# EAGLE design FXIMU (EAGLE 7.7.0)
COMPANY: ADAFRUIT INDUSTRIES; DRAWN: KTOWN; REV: A

## Sheet 1 of 2
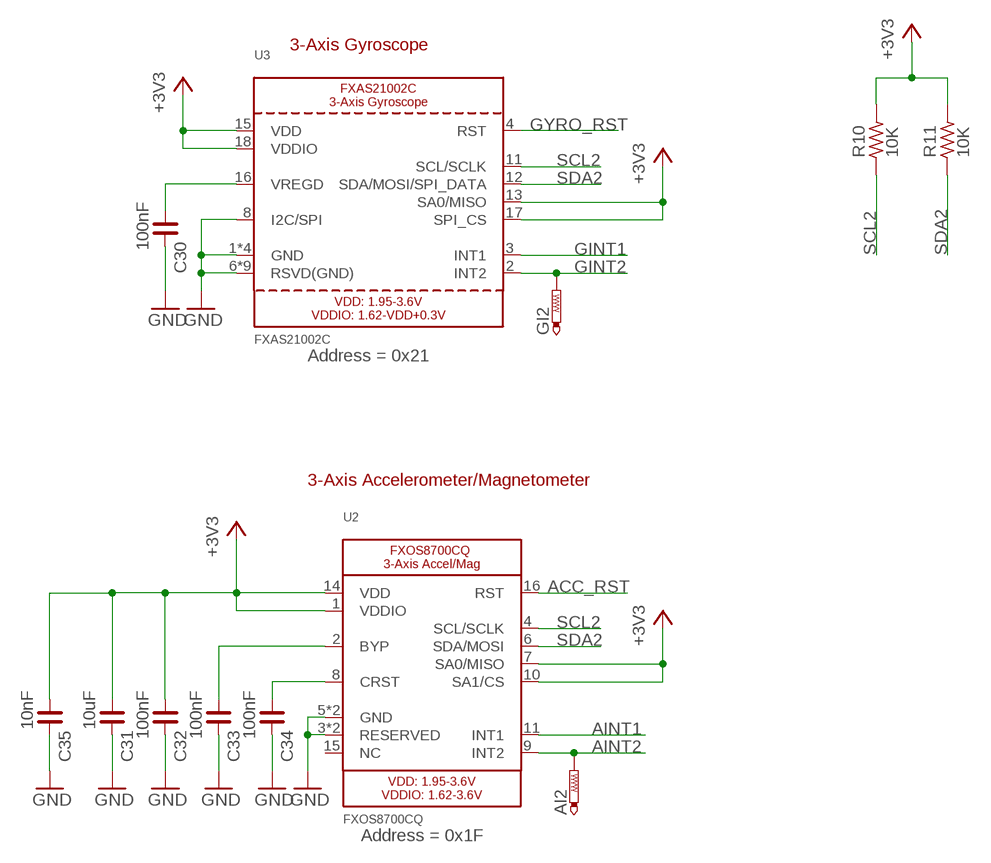
[diagram p0: schematic, sheet 1]

### Parts
AI2  PTR1TP06R  [TP06R]
C30  100nF  C_0402  [C0402]
C31  10uF  C_0603  [C0603]
C32  100nF  C_0402  [C0402]
C33  100nF  C_0402  [C0402]
C34  100nF  C_0402  [C0402]
C35  10nF  C_0402  [C0402]
GI2  PTR1TP06R  [TP06R]
R10  10K  R_0402  [R0402]
R11  10K  R_0402  [R0402]
U2  FXOS8700CQ  ACCEL_MAG_FXOS8700CQ  [QFN16_3MM_FREESCALE_5X3]
U3  FXAS21002C  GYRO_FXAS21002C  [QFN24_4MM_FREESCALE_7X5]

### Nets
+3V3: C31.1 C32.1 C35.1 R10.2 R11.2 U2.1(VDDIO) U2.7(SA0/MISO) U2.10(SA1/CS) U2.14(VDD) U3.13(SA0/MISO) U3.15(VDD) U3.17(SPI_CS) U3.18(VDDIO) ; also sheet 2
ACC_RST: U2.16(RST) ; also sheet 2
AINT1: U2.11(INT1) ; also sheet 2
AINT2: AI2.TP U2.9(INT2) ; also sheet 2
GINT1: U3.3(INT1) ; also sheet 2
GINT2: GI2.TP U3.2(INT2) ; also sheet 2
GND: C30.2 C31.2 C32.2 C33.2 C34.2 C35.2 U2.3(RESERVED) U2.5(GND) U2.12(GND) U2.13(RESERVED) U3.1(GND) U3.5(GND) U3.6(RSVD(GND)) U3.7(RSVD(GND)) U3.8(I2C/SPI) U3.9(RSVD(GND)) U3.10(RSVD(GND)) U3.14(GND) U3.19(GND) U3.20(RSVD(GND)) U3.21(RSVD(GND)) U3.22(RSVD(GND)) U3.23(RSVD(GND)) U3.24(RSVD(GND)) ; also sheet 2
GYRO_RST: U3.4(RST) ; also sheet 2
N$1: C30.1 U3.16(VREGD)
N$24: C33.1 U2.2(BYP)
N$26: C34.1 U2.8(CRST)
SCL2: R10.1 U2.4(SCL/SCLK) U3.11(SCL/SCLK) ; also sheet 2
SDA2: R11.1 U2.6(SDA/MOSI) U3.12(SDA/MOSI/SPI_DATA) ; also sheet 2
Unconnected: U2.15(NC)

### Notes on the sheet
- 3-Axis Gyroscope
- Address = 0x21
- 3-Axis Accelerometer/Magnetometer
- Address = 0x1F

## Sheet 2 of 2
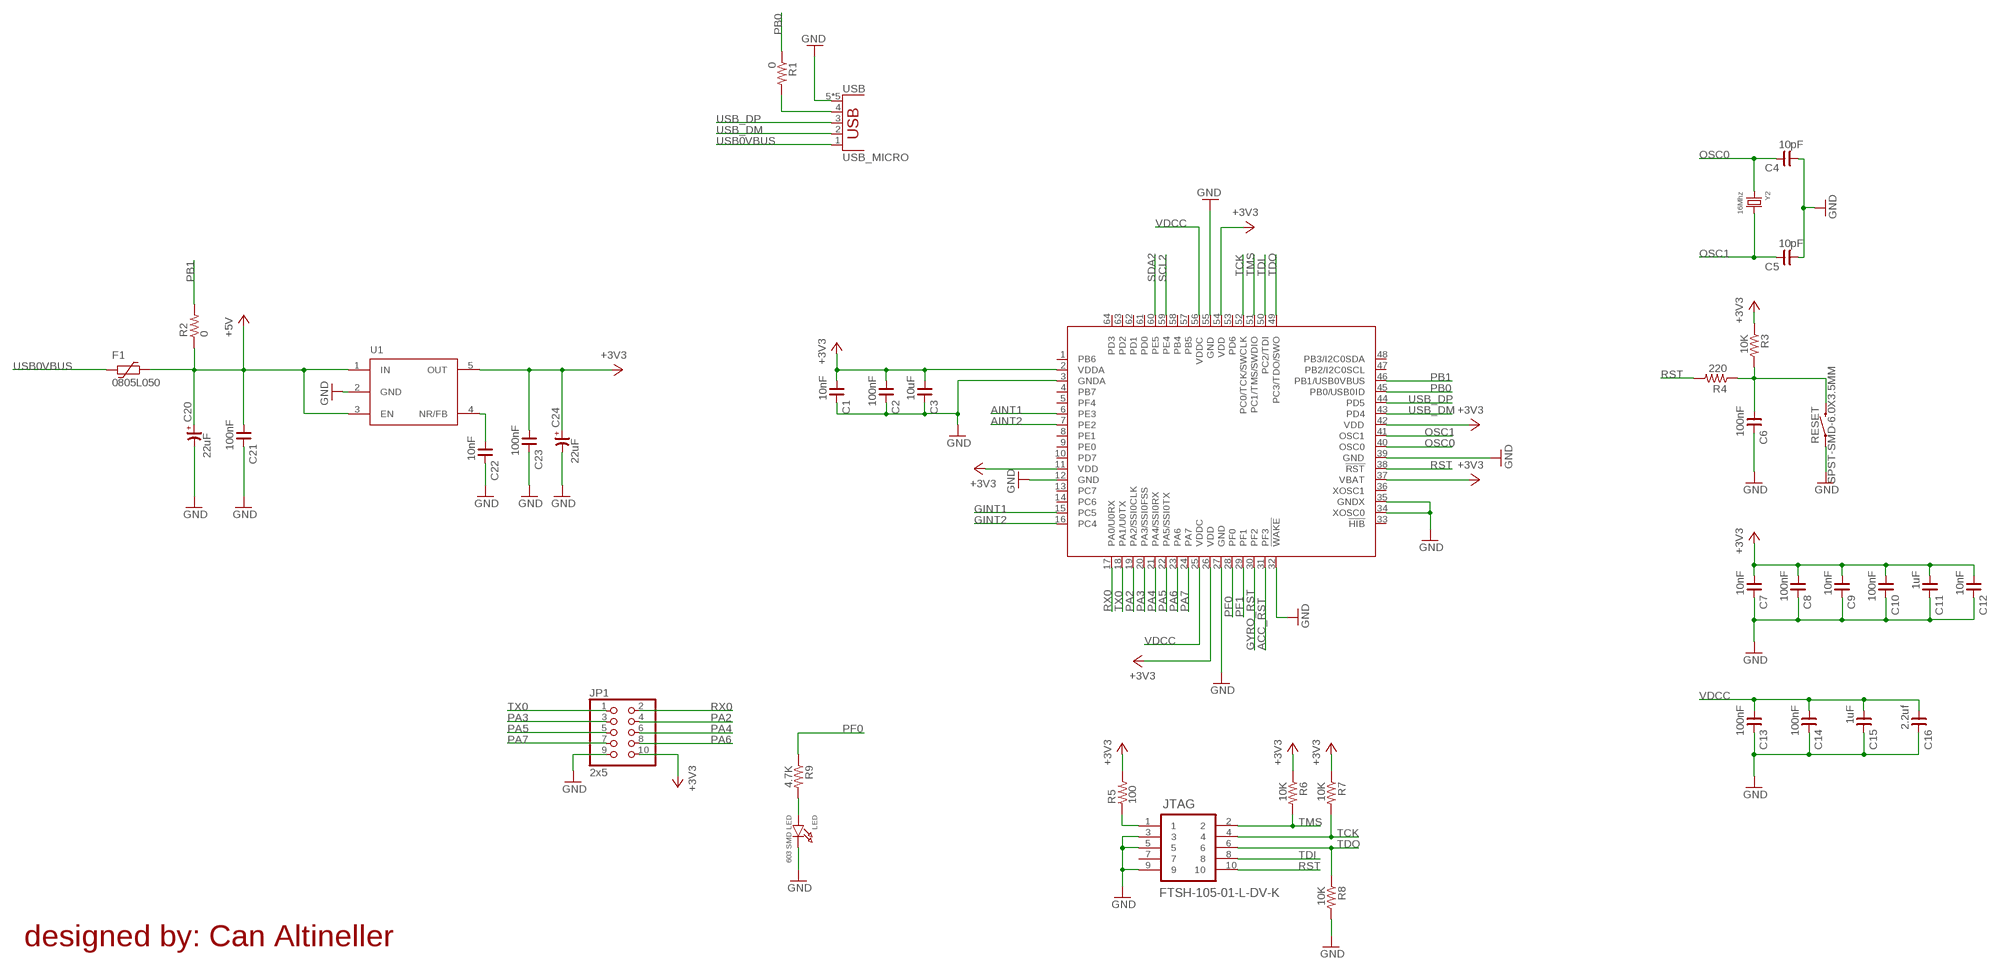
[diagram p1: schematic, sheet 2]

### Parts
C1  10nF  C_0402  [C0402]
C2  100nF  C_0402  [C0402]
C3  10uF  C_0603  [C0603]
C4  10pF  C_0402  [C0402]
C5  10pF  C_0402  [C0402]
C6  100nF  C_0402  [C0402]
C7  10nF  C_0402  [C0402]
C8  100nF  C_0402  [C0402]
C9  10nF  C_0402  [C0402]
C10  100nF  C_0402  [C0402]
C11  1uF  C_0402  [C0402]
C12  10nF  C_0402  [C0402]
C13  100nF  C_0402  [C0402]
C14  100nF  C_0402  [C0402]
C15  1uF  C_0402  [C0402]
C16  2.2uf  C_0603  [C0603]
C20  22uF  CP_3528-21  [C3528-21/T]
C21  100nF  C_0402  [C0402]
C22  10nF  C_0402  [C0402]
C23  100nF  C_0402  [C0402]
C24  22uF  CP_3528-21  [C3528-21/T]
F1  0805L050  [0805L]
IC1  TM4C123[7,G]XXPM  [PM_S-PQFP-G64]
JP1  2x5  PINHD-2X5  [2X05]
JTAG  FTSH-105-01-L-DV-K  [SAMTEC_FTSH-105-01-L-DV-K]
LED  603 SMD LED  LED0603  [CHIPLED_0603]
R1  0  R_0402  [R0402]
R2  0  R_0402  [R0402]
R3  10K  R_0402  [R0402]
R4  220  R_0402  [R0402]
R5  100  R_0402  [R0402]
R6  10K  R_0402  [R0402]
R7  10K  R_0402  [R0402]
R8  10K  R_0402  [R0402]
R9  4.7K  R_0402  [R0402]
RESET  SPST-SMD-6.0X3.5MM  MOMENTARY-SWITCH-SPST-SMD-6.0X3.5MM  [TACTILE_SWITCH_SMD_6.0X3.5MM]
U1  TPS73633  [SOT23-5L]
USB  USB_MICRO  [USB_MICRO_MOLEX_FULL]
Y2  16Mhz  CRYSTAL.6X3.3MM  [6X3.3MM]

### Nets
+3V3: C1.1 C2.1 C3.1 C7.1 C8.1 C9.1 C10.1 C11.1 C12.1 C23.1 C24.+ IC1.2(VDDA) IC1.11(VDD) IC1.26(VDD) IC1.37(VBAT) IC1.42(VDD) IC1.54(VDD) JP1.10 R3.1 R5.2 R6.1 R7.1 U1.5(OUT) ; also sheet 1
+5V: C20.+ C21.1 F1.1 R2.1 U1.1(IN) U1.3(EN)
ACC_RST: IC1.31(PF3) ; also sheet 1
AINT1: IC1.6(PE3) ; also sheet 1
AINT2: IC1.7(PE2) ; also sheet 1
GINT1: IC1.15(PC5) ; also sheet 1
GINT2: IC1.16(PC4) ; also sheet 1
GND: C1.2 C2.2 C3.2 C4.1 C5.1 C6.2 C7.2 C8.2 C9.2 C10.2 C11.2 C12.2 C13.2 C14.2 C15.2 C16.2 C20.- C21.2 C22.2 C23.2 C24.- IC1.3(GNDA) IC1.12(GND) IC1.27(GND) IC1.32(!WAKE) IC1.34(XOSC0) IC1.35(GNDX) IC1.39(GND) IC1.55(GND) JP1.9 JTAG.3 JTAG.5 JTAG.9 LED.C R8.2 RESET.1 U1.2(GND) USB.5(GND) USB.P$1(GND) USB.P$2(GND) USB.P$3(GND) USB.P$4(GND) ; also sheet 1
GYRO_RST: IC1.30(PF2) ; also sheet 1
N$2: JTAG.1 R5.1
N$4: C6.1 R3.2 R4.1 RESET.2
N$7: LED.A R9.2
N$8: R1.2 USB.4(ID)
N$17: C22.1 U1.4(NR/FB)
OSC0: C4.2 IC1.40(OSC0) Y2.1
OSC1: C5.2 IC1.41(OSC1) Y2.2
PA2: IC1.19(PA2/SSI0CLK) JP1.4
PA3: IC1.20(PA3/SSI0FSS) JP1.3
PA4: IC1.21(PA4/SSI0RX) JP1.6
PA5: IC1.22(PA5/SSI0TX) JP1.5
PA6: IC1.23(PA6) JP1.8
PA7: IC1.24(PA7) JP1.7
PB0: IC1.45(PB0/USB0ID) R1.1
PB1: IC1.46(PB1/USB0VBUS) R2.2
PF0: IC1.28(PF0) R9.1
PF1: IC1.29(PF1)
RST: IC1.38(!RST) JTAG.10 R4.2
RX0: IC1.17(PA0/U0RX) JP1.2
SCL2: IC1.59(PE4) ; also sheet 1
SDA2: IC1.60(PE5) ; also sheet 1
TCK: IC1.52(PC0/TCK/SWCLK) JTAG.4 R7.2
TDI: IC1.50(PC2/TDI) JTAG.8
TDO: IC1.49(PC3/TDO/SWO) JTAG.6 R8.1
TMS: IC1.51(PC1/TMS/SWDIO) JTAG.2 R6.2
TX0: IC1.18(PA1/U0TX) JP1.1
USB0VBUS: F1.2 USB.1(VBUS)
USB_DM: IC1.43(PD4) USB.2(D-)
USB_DP: IC1.44(PD5) USB.3(D+)
VDCC: C13.1 C14.1 C15.1 C16.1 IC1.25(VDDC) IC1.56(VDDC)
Unconnected: IC1.1(PB6) IC1.4(PB7) IC1.5(PF4) IC1.8(PE1) IC1.9(PE0) IC1.10(PD7) IC1.13(PC7) IC1.14(PC6) IC1.33(!HIB) IC1.36(XOSC1) IC1.47(PB2/I2C0SCL) IC1.48(PB3/I2C0SDA) IC1.53(PD6) IC1.57(PB5) IC1.58(PB4) IC1.61(PD0) IC1.62(PD1) IC1.63(PD2) IC1.64(PD3) JTAG.7

### Notes on the sheet
- designed by: Can Altineller

## Library data of the parts
AI2 GI2 = testpad:PTR1: TEST PIN
C1-C16 C21-C23 C30-C35 = rc-master-smd:C_: NON-POLARIZED CAP
C20 C24 = rc-master-smd:CP_: POLARIZED CAP
F1 = polyfuse-smd_10:?: Polyfuse Resettable PTC Source: http://www.littelfuse.com/products/resettable-ptcs.aspx; MF: Littelfuse; MPN: 0805L050; OC_FARNELL: 1832103; OC_NEWARK: 18M4776
IC1 = ti-tiva:TM4C123[7,G]XX
JP1 = pinhead:PINHD-2X5: PIN HEADER
JTAG = FTSH-105-01-L-DV-K:FTSH-105-01-L-DV-K: CONN HEADER, 1.27MM, 2X5WAY, SMT; AVAILABILITY: Good; DESCRIPTION: Conn Unshrouded Header HDR 10 POS 1.27mm Solder ST SMD Automotive Tube; MF: Samtec; MP: FTSH-105-01-L-DV-K; PACKAGE: TSSOP-20 Texas Instruments; PRICE: 1.93 USD
LED = microbuilder:LED: LED 0603 - 0603 Surface Mount Package 2mA: Green LED - Low Power (3.9mcd, 2ma, 1.7Vf) - Digikey: 475-2709-2-ND Orange LED - Low Power (9.8mcd, 2ma, 1.8Vf) - Digikey: 475-1194-2-ND Red LED - Low Power (5mcd, 2ma, 1.8Vf) - Digikey: 475-1195-2-ND Yellow LED - Low Power (7mcd, 2ma, 1.8Vf) - Digikey: 475-1196-2-ND 5mA: Blue LED - Low Power (17mcd, 5ma, 2.9Vf) - Digikey: LNJ937W8CRACT-ND 0805 - 0805 Surface Mount Package 2mA: Red LED (8.8mcd, 2mA, 1.8Vf, Clear) - Low Power [Digikey: 475-2510-1-ND] Green LED (5mcd, 2mA, 1.8Vf, Clear) - Low Power [Digikey: 475-2730-1-ND] Yellow LED (11.3mcd, 2mA, 1.8Vf, Clear) - Low Power [Digikey: 475-2555-1-ND] 20mA: Red LED (104mcd, 20mA, Diffused) - LS R976 [Digikey: 475-1278-6-ND] Red LED (12mcd, 20mA, 2.0Vf, Clear) - APT2012EC [Digikey: 754-1128-1-ND] Green LED (15mcd, 20mA, 2.2Vf, Clear) - APT2012GC [Digikey: 754-1131-1-ND] Orange LED (160mcd, 20mA, 2.1Vf, Clear) - APT2012SECK [Digikey: 754-1130-1-ND] 1206 - 1206 Surface Mount Package Green LED (26mcd, 20mA, Diffused) - LG N971 [Digikey: 475-1407-6-ND] Red LED (15mcd, 20mA, Diffused) - LH N974 [Digikey: 475-1416-6-ND]
R1-R11 = rc-master-smd:R_: RESISTOR
RESET = SparkFun-Switches:MOMENTARY-SWITCH-SPST: Momentary Switch (Pushbutton) - SPST Normally-open (NO) SPST momentary switches (buttons, pushbuttons). Variants PTH-12MM - 12mm square, through-hole Momentary Pushbutton Switch - 12mm Square <https://www.sparkfun.com/products/9190> (COM-09190) PTH-6.0MM, PTH-6.0MM-KIT - 6.0mm square, through-hole Mini Pushbutton Switch <https://www.sparkfun.com/products/97> (COM-00097) KIT package intended for soldering kit's - only one side of pads' copper is exposed. PTH-RIGHT-ANGLE-KIT - Right-angle, through-hole Right Angle Tactile Button <https://www.sparkfun.com/products/10791> - Used on SparkFun BigTime Watch Kit <https://www.sparkfun.com/products/11734> SMD-12MM - 12mm square, surface-mount Tactile Button - SMD (12mm) <https://www.sparkfun.com/products/12993> (COM-12993) Used on SparkFun PicoBoard <https://www.sparkfun.com/products/11888> SMD-4.5MM - 4.5mm Square Trackball Switch Used on SparkFun Blackberry Trackballer Breakout <https://www.sparkfun.com/products/13169> SMD-4.6MMX2.8MM - 4.60mm x 2.80mm, surface mount Used on SparkFun SAMD21 Mini Breakout <https://www.sparkfun.com/products/13664> SMD-5.2MM, SMD-5.2-REDUNDANT - 5.2mm square, surface-mount Mini Pushbutton Switch - SMD <https://www.sparkfun.com/products/8720> (COM-08720) Used on Arduino Pro Mini <https://www.sparkfun.com/products/11114> REDUNDANT package connects both switch circuits together SMD-6.0X3.5MM - 6.0 x 3.5mm, surface mount Momentary Reset Switch SMD <https://www.sparkfun.com/products/8229> (COM-08229) SMD-6.2MM-TALL - 6.2mm square, surface mount Tactile Button - SMD (6mm) <https://www.sparkfun.com/products/12992> Used on SparkFun Digital Sandbox <https://www.sparkfun.com/products/12651> SMD-RIGHT-ANGLE - Right-angle, surface mount Used on SparkFun Block for Intel® Edison - Arduino <https://www.sparkfun.com/products/13036>; PROD_ID: SWCH-00815; SF_SKU: COM-08229
U1 = tpslib:TPS73633
U2 = microbuilder:ACCEL_MAG_FXOS8700CQ: FX0S8700CQ - 3-Axis Accelerometer and Magnetometer Accel Range: +/-2/4/8 g Accel Data Rate: 1.6-800Hz (400Hz in hybrid mode) Accel Resolution: 14-bits Mag Range: 1200uT Mag Data Rate: 1.6-800Hz (400Hz in hybrid mode) Mag Resolution: 16-bits
U3 = microbuilder:GYRO_FXAS21002C: FXAS21002C - 3 Axis Gyroscope - 250/500/1000/2000dps Range: 250/500/1000/2000 dps Data Rate: 2.5-800Hz Resolution: 16-bits
USB = FLYTRON:USB_MICRO
Y2 = abracon:CRYSTAL

## Board
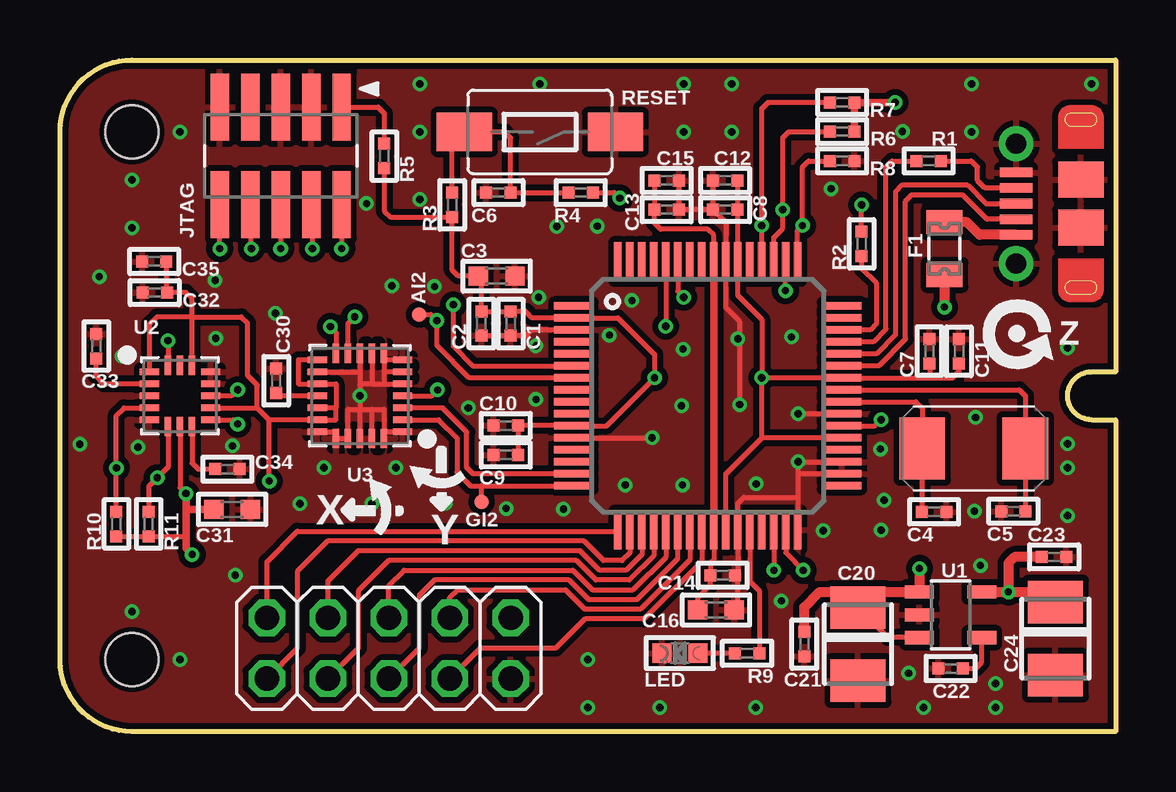
[diagram p2: board, top side]
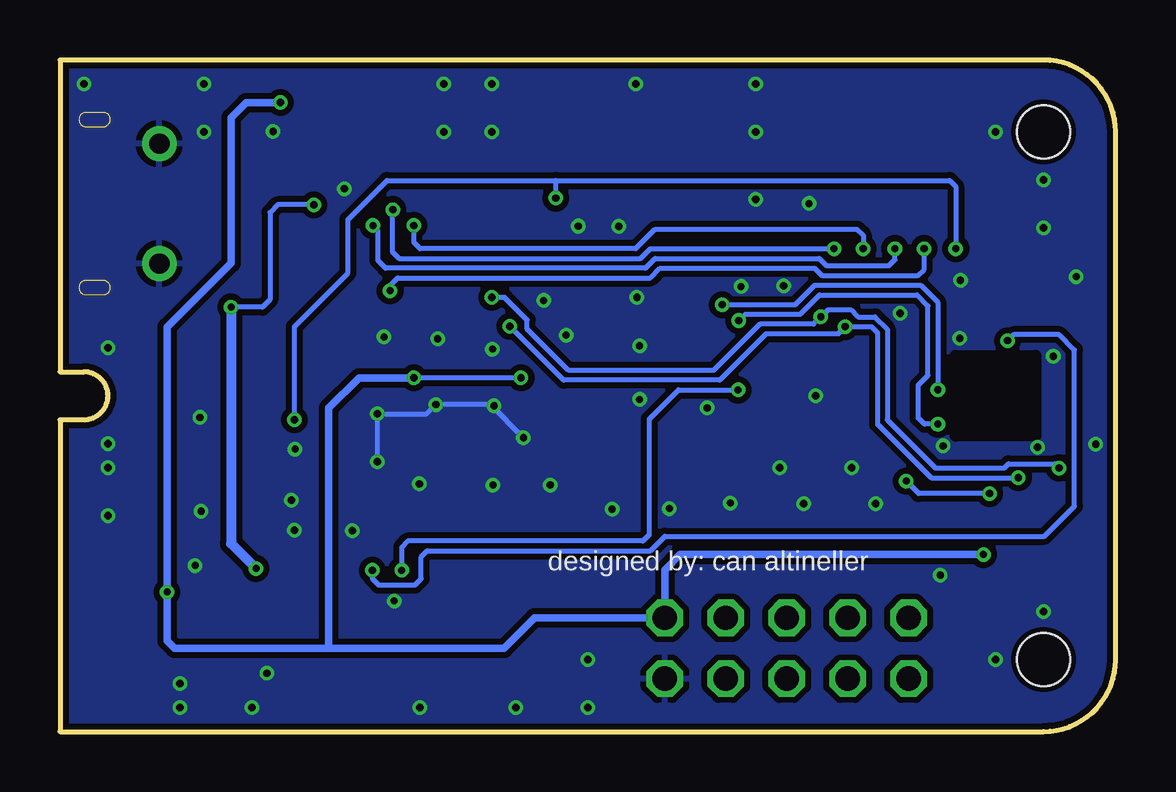
[diagram p3: board, bottom side, seen from below]

Size 44 x 28 mm. Coordinates in mm from the lower left corner, seen from the top.
Outline: 44,0 3,0 arc-90 0,3 0,25 arc-90 3,28 44,28 44,15 43,15 arc180 43,13 44,13 44,0
Copper layers (1*16): Top 0.035mm / dielectric 1.5mm / Bottom 0.035mm
Design rules "adafruit *": minimum track width 6mil, minimum drill 11mil, track to track 6mil, track to pad 6mil, pad to pad 6mil, via to via 6mil, smd to smd 0mil, copper to edge 10mil, drill to drill 10mil, minimum pad ring 10mil, minimum via ring 6mil, stop-mask expansion 2mil, vias tented up to drill 12mil, thermal gap 10mil
Holes 2.2 mm at 3,3 3,25
tRestrict: area 12.7,15.3 to 12.8,16.2; area 13.2,15.3 to 13.3,16.2; area 13.8,15.2 to 14.7,15.3; area 13.8,14.7 to 14.7,14.8; area 12.2,11.8 to 12.3,12.7; area 13.2,11.8 to 13.3,12.7; area 4.3,13.3 to 5.7,14.7
bRestrict: area 3.3,12.3 to 6.7,15.7

### Footprints (pad centres in the part's own frame; a part is rotated, then mirrored left to right if it is on the bottom)
TP06R = smd 0.6 x 0.6: TP 0,0
C0402 = smd 0.5 x 0.5: 1 -0.508,0; 2 0.508,0
C0603 = smd 0.8 x 0.8: 1 -0.762,0; 2 0.762,0
C3528-21/T = smd 1.778 x 2.286: + 1.524,0; - -1.524,0
0805L = smd 1 x 1.5: 1 -1.1,0; 2 1.1,0
PM_S-PQFP-G64 = smd 1.6 x 0.3: 1 -5.6,3.75; 2 -5.6,3.25; 3 -5.6,2.75; 4 -5.6,2.25; 5 -5.6,1.75; 6 -5.6,1.25; 7 -5.6,0.75; 8 -5.6,0.25; 9 -5.6,-0.25; 10 -5.6,-0.75; 11 -5.6,-1.25; 12 -5.6,-1.75; 13 -5.6,-2.25; 14 -5.6,-2.75; 15 -5.6,-3.25; 16 -5.6,-3.75; 33 5.6,-3.75; 34 5.6,-3.25; 35 5.6,-2.75; 36 5.6,-2.25; 37 5.6,-1.75; 38 5.6,-1.25; 39 5.6,-0.75; 40 5.6,-0.25; 41 5.6,0.25; 42 5.6,0.75; 43 5.6,1.25; 44 5.6,1.75; 45 5.6,2.25; 46 5.6,2.75; 47 5.6,3.25; 48 5.6,3.75 | smd 0.3 x 1.6: 17 -3.75,-5.6; 18 -3.25,-5.6; 19 -2.75,-5.6; 20 -2.25,-5.6; 21 -1.75,-5.6; 22 -1.25,-5.6; 23 -0.75,-5.6; 24 -0.25,-5.6; 25 0.25,-5.6; 26 0.75,-5.6; 27 1.25,-5.6; 28 1.75,-5.6; 29 2.25,-5.6; 30 2.75,-5.6; 31 3.25,-5.6; 32 3.75,-5.6; 49 3.75,5.6; 50 3.25,5.6; 51 2.75,5.6; 52 2.25,5.6; 53 1.75,5.6; 54 1.25,5.6; 55 0.75,5.6; 56 0.25,5.6; 57 -0.25,5.6; 58 -0.75,5.6; 59 -1.25,5.6; 60 -1.75,5.6; 61 -2.25,5.6; 62 -2.75,5.6; 63 -3.25,5.6; 64 -3.75,5.6
2X05 = drill 1.016 octagon: 1 -5.08,-1.27; 2 -5.08,1.27; 3 -2.54,-1.27; 4 -2.54,1.27; 5 0,-1.27; 6 0,1.27; 7 2.54,-1.27; 8 2.54,1.27; 9 5.08,-1.27; 10 5.08,1.27
SAMTEC_FTSH-105-01-L-DV-K = smd 0.762 x 2.794: 1 -2.54,-2.032; 2 -2.54,2.032; 3 -1.27,-2.032; 4 -1.27,2.032; 5 0,-2.032; 6 0,2.032; 7 1.27,-2.032; 8 1.27,2.032; 9 2.54,-2.032; 10 2.54,2.032
CHIPLED_0603 = smd 0.8 x 0.8: A 0,-0.75; C 0,0.75
R0402 = smd 0.5 x 0.5: 1 -0.508,0; 2 0.508,0
TACTILE_SWITCH_SMD_6.0X3.5MM = smd 2.3 x 1.6: 1 -3.15,0; 2 3.15,0
SOT23-5L = smd 0.55 x 1.2: 1 -0.95,-1.3; 2 0,-1.3; 3 0.95,-1.3; 4 0.95,1.3; 5 -0.95,1.3
QFN16_3MM_FREESCALE_5X3 = smd 0.8 x 0.275: 1 -1.275,1; 2 -1.275,0.5; 3 -1.275,0; 4 -1.275,-0.5; 5 -1.275,-1; 9 1.275,-1; 10 1.275,-0.5; 11 1.275,0; 12 1.275,0.5; 13 1.275,1 | smd 0.275 x 0.8: 6 -0.5,-1.275; 7 0,-1.275; 8 0.5,-1.275; 14 0.5,1.275; 15 0,1.275; 16 -0.5,1.275
QFN24_4MM_FREESCALE_7X5 = smd 0.8 x 0.275: 1 -1.775,1.5; 2 -1.775,1; 3 -1.775,0.5; 4 -1.775,0; 5 -1.775,-0.5; 6 -1.775,-1; 7 -1.775,-1.5; 13 1.775,-1.5; 14 1.775,-1; 15 1.775,-0.5; 16 1.775,0; 17 1.775,0.5; 18 1.775,1; 19 1.775,1.5 | smd 0.275 x 0.8: 8 -1,-1.775; 9 -0.5,-1.775; 10 0,-1.775; 11 0.5,-1.775; 12 1,-1.775; 20 1,1.775; 21 0.5,1.775; 22 0,1.775; 23 -0.5,1.775; 24 -1,1.775
USB_MICRO_MOLEX_FULL = smd 0.4 x 1.35: 1 -1.29,2.644; 2 -0.64,2.644; 3 0.01,2.644; 4 0.66,2.644; 5 1.31,2.644 | drill 0.85 pad 1.45: P$1 -2.49,2.644; P$2 2.51,2.644 | smd 1.5 x 1.9: P$3 1.01,-0.056; P$4 -0.99,-0.056
6X3.3MM = smd 1.9 x 2.6: 1 -2.15,0; 2 2.15,0

### Placement (x,y rotation side)
AI2  14.98,17.39 0 top
C1  18.79,17.01 270 top
C2  17.57,17.01 270 top
C3  18.2,18.99 0 top
C4  36.44,9.16 180 top
C5  39.74,9.19 0 top
C6  18.28,22.47 180 top
C7  36.24,15.86 90 top
C8  27.73,21.76 180 top
C9  18.58,11.53 180 top
C10  18.58,12.75 180 top
C11  37.48,15.86 90 top
C12  27.73,22.98 180 top
C13  25.29,21.76 0 top
C14  27.62,6.52 0 top
C15  25.29,22.98 0 top
C16  27.35,5.07 0 top
C20  33.26,3.65 90 top
C21  31.03,3.65 270 top
C22  37.12,2.63 180 top
C23  41.44,7.28 0 top
C24  41.49,3.88 90 top
C30  9.01,14.62 90 top
C31  7.18,9.26 0 top
C32  3.95,18.3 180 top
C33  1.51,16.07 90 top
C34  6.98,10.94 0 top
C35  3.93,19.6 180 top
F1  36.87,20.13 90 top
GI2  17.57,9.57 0 top
IC1  27,14 0 top
JP1  13.71,3.47 0 top
JTAG  9.2,24 180 top
LED  25.85,3.27 90 top
R1  36.21,23.79 0 top
R2  33.42,20.34 270 top
R3  16.35,21.96 90 top
R4  21.71,22.47 0 top
R5  13.52,23.99 270 top
R6  32.6,25.01 180 top
R7  32.6,26.23 180 top
R8  32.6,23.79 0 top
R9  28.64,3.27 180 top
R10  2.35,8.65 270 top
R11  3.7,8.65 270 top
RESET  20,25 180 top
U1  37.12,4.87 270 top
U2  5,14 0 top
U3  12.5,14 180 top
U$27  [SYMBOL_GYRO_CCLOCKWISE]  11.68,7.98 0 top
U$28  [SYMBOL_GYRO_CLOCKWISE]  14.3,12.23 270 top
U$31  [SYMBOL_GYRO_Z]  38.46,15.12 0 top
USB  42.5,22 90 top
Y2  38.09,11.8 0 top

### Tracks (layer width: path | path; a pad name or v marks a point on that pad's centre or on a via)
+3V3  (via drill 0.3)
  Top 0.203: C12.1 C8.1 28.25,21.74 IC1.54 28.25,18.19 29.25,17.18 v29.25,14.75 | 36.26,14.75 IC1.42 v29.25,14.75 | 36.26,14.75 37.22,14.75 37.48,15 C11.1 | C7.1 36.26,15.35 36.26,14.75 | U2.14 | U2.14 | U3.13 9.93,15.5 9.93,14.5 U3.15 11.5,14.5 11.5,13.5 | 11.5,13.5 U3.17 | 11.5,13.5 11.5,13 U3.18 8.72,13 | IC1.26 27.75,10.75 29.25,12.25 | C9.1 C10.1 IC1.11 22.78,12.75 v24.78,14.75 24.78,15.73 23.26,17.25 IC1.2 19.69,17.25 19.42,17.52 C1.1 C2.1 17.57,18.86 C3.1 16.6,18.99 16.35,19.24 R3.1 13.77,21.45 13.52,21.71 R5.2 | IC1.37 29.25,12.25 | 29.25,12.25 v29.25,14.75 | U2.7 5,10.18 v5.25,9.92 | U2.1 3.73,16.97 4.04,17.29 5.5,17.29 | U2.10 8.22,13.5 | U2.14 5.5,17.29 | 5.5,17.29 7.56,17.29 7.81,17.03 7.81,14.85 8.22,14.44 8.22,13.5 | 8.22,13.5 8.72,13 | R10.2 R11.2 5.25,8.14 | 5.5,17.29 5.5,18.05 5.25,18.3 C32.1 4.44,18.33 C35.1 | v8.72,10.44 8.72,13
  Top 0.305: v34.81,26.23 R7.1 R6.1 | v5.51,7.38 5.25,7.64 5.25,8.14 5.25,9.16 | 5.25,9.16 v5.25,9.92 | C31.1 5.36,9.26 5.25,9.16
  Top 0.406: U1.5 v39.54,5.82 | v39.54,5.82 41.24,5.82 41.49,5.56 C24.+ | C23.1 39.79,7.28 39.54,7.03 v39.54,5.82
  Bottom 0.203: v24.78,14.75 v29.25,14.75 | v5.25,9.92 8.2,9.92 v8.72,10.44
  Bottom 0.305: v34.81,26.23 36.23,26.23 36.87,25.59 36.87,19.52 39.54,16.86 v39.54,5.82 39.54,3.79 39.22,3.47 32.81,3.47 | v29.25,14.75 31.54,14.75 32.81,13.48 32.81,3.47 | v5.51,7.38 18.15,7.38 18.79,6.75 JP1.10 24.22,4.74 25.49,3.47 32.81,3.47
+5V  (via drill 0.3)
  Top 0.203: U1.3 34.52,3.92 C20.+ | R2.1 v33.42,21.96
  Top 0.406: F1.1 v36.87,17.69 | C21.1 31.03,5.18 31.66,5.82 33.31,5.82 | 33.31,5.82 U1.1 v35.83,6.8 | C20.+ 33.26,5.77 33.31,5.82
  Bottom 0.203: v33.42,21.96 34.93,21.96 35.25,21.64 35.25,18.01 35.56,17.69 v36.87,17.69
  Bottom 0.406: v36.87,17.69 36.87,7.84 v35.83,6.8
ACC_RST  (via drill 0.3)
  Top 0.203: v4.5,16.3 U2.16 | IC1.31 30.25,7.45 v30.98,6.72
  Bottom 0.203: v4.5,16.3 4.25,16.55 2.35,16.55 1.72,15.92 1.72,9.39 2.96,8.14 18.79,8.14 19.39,7.53 28.69,7.53 28.95,7.28 28.95,6.37 29.2,6.11 30.72,6.11 30.98,6.37 v30.98,6.72
AINT1  (via drill 0.3)
  Top 0.203: v7.41,14.25 7.15,14 U2.11 | IC1.6 17.21,15.25 16.4,16.06 v16.4,17.8
  Bottom 0.203: v7.41,14.25 7.41,17.9 8.12,18.61 12.54,18.61 13.35,17.8 v16.4,17.8
AINT2  (via drill 0.3)
  Top 0.203: IC1.7 17.06,14.75 15.71,16.1 v15.71,17.14 15.46,17.39 AI2.TP | U2.9 7.22,13 v7.41,12.82
  Bottom 0.203: v15.71,17.14 15.43,17.39 13.15,17.39 12.33,18.2 8.27,18.2 7.81,17.75 7.81,14.85 8.22,14.44 8.22,13.07 7.96,12.82 v7.41,12.82
GINT1
  Top 0.203: IC1.15 17.21,10.75 16.96,11 16.96,12.48 15.94,13.5 U3.3
GINT2
  Top 0.203: U3.2 15.79,13 16.55,12.24 16.55,10.81 17.11,10.25 17.57,10.25 | 17.57,10.25 IC1.16 | GI2.TP 17.57,10.25
GND  (via drill 0.3)
  Top 0.203: C12.2 C8.2 | C15.2 C13.2 C8.2 | C8.2 27.75,21.23 IC1.55 27.75,17.67 28.34,17.09 v28.34,13.63 | U3.14 12.5,15 | 13.5,15 U3.8 13.5,15.5 U3.7 | 13.5,14.5 U3.5 | U3.6 13.5,15 | 13.5,15 13.5,14.5 | U3.9 13,14.5 | U3.10 12.5,15 | 12.5,13.43 12,13.43 U3.21 U3.20 11.5,12.5 U3.19 | 12.52,13.43 13,13.43 | 13,13.43 13.5,13.43 U3.24 13.5,12.5 U3.1 | U3.22 12.52,12.22 12.52,13.43 | U3.23 13,13.43 | 12.5,15 12.5,14.44 | 12.5,14.44 12.5,13.43 | 12.5,13.43 12.52,13.43 | 13,14.5 12.56,14.5 arc90 12.5,14.44 | 13,14.5 13.5,14.5 | IC1.3 19.67,16.75 19.42,16.5 C1.2 C2.2 | IC1.32 30.77,8.4 30.77,9.77 | 30.77,9.77 30.77,10.75 | 30.77,10.75 v30.77,11.25 IC1.35 | IC1.34 30.77,10.75 | IC1.39 v30.77,13.25 | 30.77,9.77 28.5,9.77 28.25,9.52 IC1.27 28.25,6.64 C14.2 28.26,6.39 28.26,5.22 C16.2 | IC1.12 v24.68,12.25
  Bottom 0.203: v30.77,11.25 v30.77,13.25 28.72,13.25 v28.34,13.63 26.06,13.63 v24.68,12.25
  other vias: 12.5,14 17.02,13.49 20.7,21.06 19.84,16.08 19.84,13.85 5,25 3,23 3,5 5,3 3,21 15,25 26,25 28,25 38,25 43,27 38,27 28,27 26,27 15,27 42,16 42,12 42,11 42,9 39,2 39,1 36,1 29,1 25,1 22,1 22,3 3.25,11.86 2.59,15.64 7.19,11.91 11,11 14,11 10,9.5 25.97,15.94 30.5,16.45 28.26,16.37 25.95,10.28 29.02,10.33 23.56,10.28 23.84,17.97 22.9,16.53 34.23,8.4 31.82,8.37 34.2,11.78 38.37,6.92 35.37,2.43 6.47,18.81 1.64,18.96 7.3,6.52 15,22.19 22.39,21.07 19.95,18.1 12.78,22.02 38.11,9.19 34.36,9.64 38.17,13.1 30.07,5.45 25.91,13.59 13,9.5 0.83,11.98 6.49,16.4 8.98,17.44 13.83,18.58 15.61,18.56 16.06,9.53 20.98,9.27 18.6,9.3 20,27 35.12,25.02 32.14,22.63
  pour Bottom (isolate 0.254): 44,28 3,28 arc90 0,25 0,3 arc90 3,0 44,0
  pour Top (isolate 0.254): 44,28 3,28 arc90 0,25 0,3 arc90 3,0 44,0
GYRO_RST  (via drill 0.3)
  Top 0.203: U3.4 15.5,14 v15.74,14.24 | IC1.30 v29.76,6.72
  Bottom 0.203: v15.74,14.24 18.23,14.24 19.45,13.02 19.45,8.2 19.7,7.94 29.5,7.94 29.76,7.69 v29.76,6.72
N$1
  Top 0.203: U3.16 9.13,14 arc-90 C30.1
N$2
  Top 0.203: JTAG.1 13.27,26.03 13.52,25.78 R5.1
N$4
  Top 0.203: R4.1 C6.1 18.79,24.75 18.53,25 RESET.2 16.35,24.5 R3.2
N$7
  Top 0.203: R9.2 LED.A
N$8
  Top 0.203: USB.4 38.56,22.66 38.24,22.98 38.24,23.54 37.99,23.79 R1.2
N$17
  Top 0.203: C22.1 38.17,2.63 38.42,2.89 U1.4
N$24
  Top 0.203: U2.2 1.83,14.5 1.51,14.82 C33.1
N$26
  Top 0.203: U2.8 5.5,11.19 5.75,10.94 C34.1
OSC0
  Top 0.203: IC1.40 35.69,13.75 35.94,13.5 Y2.1 C4.2
OSC1
  Top 0.203: IC1.41 39.99,14.25 40.24,14 Y2.2 C5.2
PA2
  Top 0.203: JP1.4 11.17,6.26 12.44,7.53 21.68,7.53 22.49,6.72 23.59,6.72 24.25,7.38 IC1.19
PA3
  Top 0.203: JP1.3 12.44,3.47 12.44,5.86 13.71,7.13 21.53,7.13 22.34,6.32 23.74,6.32 24.75,7.33 IC1.20
PA4
  Top 0.203: JP1.6 13.71,6.09 14.34,6.72 21.38,6.72 22.19,5.91 23.89,5.91 25.25,7.27 IC1.21
PA5
  Top 0.203: JP1.5 14.98,3.47 14.98,5.68 15.61,6.32 21.22,6.32 22.04,5.5 24.04,5.5 25.75,7.21 IC1.22
PA6
  Top 0.203: JP1.8 16.25,5.59 16.56,5.91 21.07,5.91 21.88,5.1 24.2,5.1 26.25,7.15 IC1.23
PA7
  Top 0.203: IC1.24 26.75,7.09 24.35,4.69 21.88,4.69 20.66,3.47 17.52,3.47 JP1.7
PB0
  Top 0.203: IC1.45 33.9,16.25 34.43,16.78 34.43,23.54 34.69,23.79 R1.1
PB1
  Top 0.203: R2.2 33.42,19.32 34.03,18.71 34.03,17 33.77,16.75 IC1.46
PF0
  Top 0.203: IC1.28 28.75,6.26 29.15,5.86 R9.1
RST  (via drill 0.3)
  Top 0.203: IC1.38 33.98,12.75 v34.23,13 | v6.66,20.13 v6.66,20.14 JTAG.10 | R4.2 23.1,22.47 v23.33,22.24
  Bottom 0.203: v34.23,13 34.23,16.88 31.99,19.12 31.99,21.35 30.37,22.98 23.33,22.98 | 23.33,22.98 6.91,22.98 6.66,22.72 v6.66,20.13 | v23.33,22.24 23.33,22.98
RX0
  Top 0.203: JP1.2 8.63,7.08 9.9,8.35 23.25,8.35 IC1.17
SCL2  (via drill 0.3)
  Top 0.203: IC1.59 25.75,18.35 v26,18.1 | U3.11 12,17 v12.28,17.29 | U2.4 2.67,13.5 2.35,13.18 v2.35,10.99 R10.1
  Bottom 0.203: v26,18.1 25.47,18.1 24.53,17.16 24.53,16.78 22.8,15.05 16.75,15.05 14.82,16.98 12.59,16.98 v12.28,17.29 11.98,17.59 11.04,17.59 10.73,17.29 10.02,17.29 9.52,16.78 9.52,12.99 7.51,10.99 4.64,10.99 4.46,11.17 2.53,11.17 v2.35,10.99
SDA2  (via drill 0.3)
  Top 0.203: IC1.60 v25.25,16.89 | v11.27,16.88 11.5,16.65 U3.12 | U2.6 4.5,11.03 v4.05,10.58 3.7,10.23 R11.1
  Bottom 0.203: v25.25,16.89 23,14.65 16.5,14.65 14.57,16.58 11.57,16.58 v11.27,16.88 10.18,16.88 9.92,16.63 9.92,12.82 7.69,10.58 v4.05,10.58
TCK  (via drill 0.3)
  Top 0.203: 10.54,21.98 10.52,21.96 v10.52,20.13 | IC1.52 | R7.2 29.5,26.23 29.25,25.98 v29.25,21.1 IC1.52
  Top 0.305: JTAG.4 10.51,21.97 10.52,21.96
  Bottom 0.203: v10.52,20.13 10.52,20.69 10.77,20.95 19.19,20.95 20.01,20.13 29,20.13 29.25,20.39 v29.25,21.1
TDI  (via drill 0.3)
  Top 0.203: v30.24,18.38 IC1.50 | v7.98,20.13 7.98,21.97 JTAG.8
  Bottom 0.203: v30.24,18.38 30.24,18.6 29.92,18.91 19.39,18.91 18.99,19.32 12.55,19.32 12.25,19.02 8.23,19.02 7.98,19.27 v7.98,20.13
TDO  (via drill 0.3)
  Top 0.203: IC1.49 30.75,20.89 v30.95,21.1 30.95,23.54 31.21,23.79 R8.1 | JTAG.6 9.2,20.34 v9.2,20.13
  Bottom 0.203: v9.2,20.13 9.2,19.68 9.45,19.42 12.04,19.42 12.35,19.73 19.19,19.73 19.6,19.32 30.43,19.32 30.75,19.64 30.75,20.89 v30.95,21.1
TMS  (via drill 0.3)
  Top 0.203: 11.74,21.39 v11.74,20.13 | IC1.51 29.75,20.59 30.13,20.97 v30.13,21.76 30.13,24.76 30.38,25.01 R6.2
  Top 0.305: 11.74,21.39 JTAG.2
  Bottom 0.203: v11.74,20.13 19.39,20.13 19.8,19.73 29.87,19.73 30.13,19.98 v30.13,21.76
TX0
  Top 0.203: IC1.18 23.75,7.45 23.43,7.13 22.65,7.13 21.83,7.94 11.17,7.94 9.9,6.67 9.9,3.47 JP1.1
USB0VBUS
  Top 0.406: USB.1 38.33,20.71 37.8,21.23 F1.2
USB_DM
  Top 0.203: IC1.43 34.13,15.25 35.25,16.37 35.25,22.11 35.5,22.37 37.63,22.37 38.64,21.36 USB.2
USB_DP
  Top 0.203: IC1.44 34.03,15.75 34.84,16.56 34.84,22.52 35.09,22.77 37.84,22.77 38.6,22.01 USB.3
VDCC
  Top 0.203: C15.1 C13.1 24.78,21.2 25.03,20.95 27,20.95 27.25,20.69 IC1.56 | 27.25,6.65 C14.1 | C16.1 26.58,5.58 27.12,6.11 C14.1 | IC1.25 27.25,7.16 27.12,7.03 C14.1
  Top 0.305: IC1.56 IC1.25

### Text on the board
tPlace: Z | X | Y
bNames: designed by: can altineller